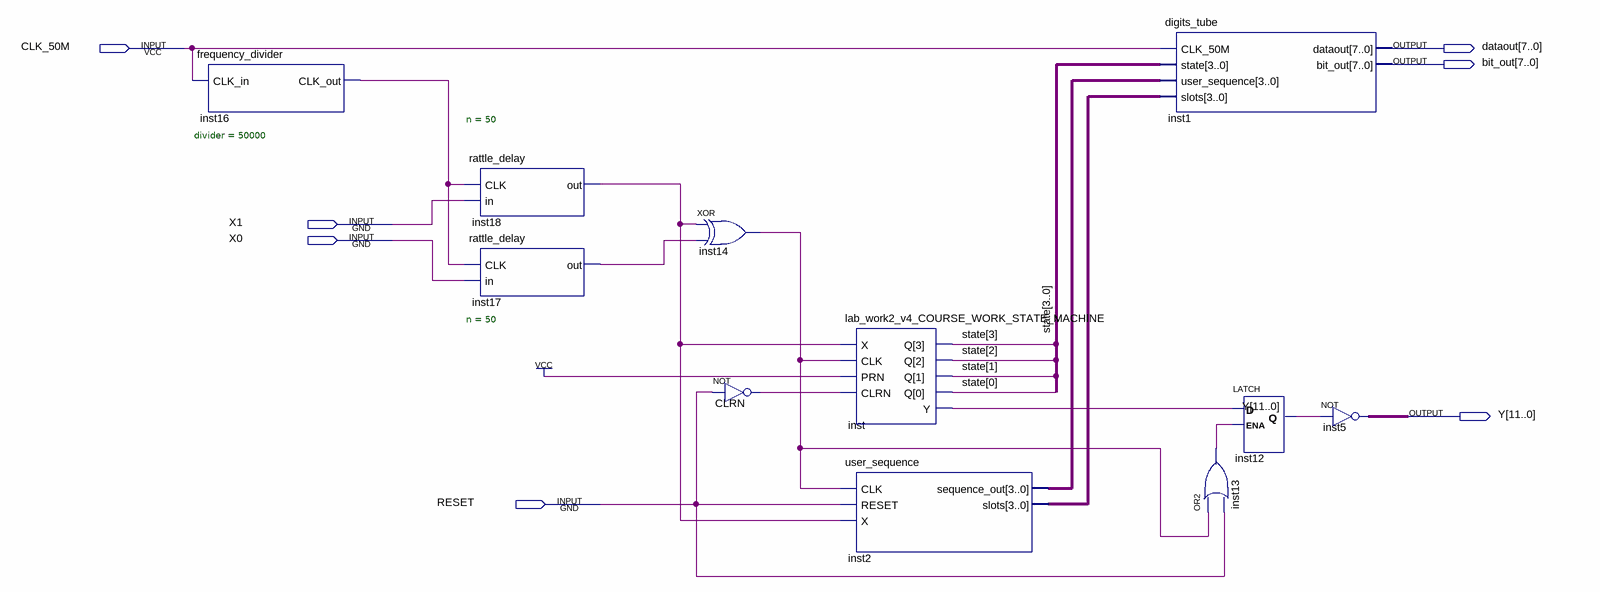
[diagram p0: schematic sheet]
// Quartus schematic lab_work2_v4.bdf as structural Verilog: 11 symbols, 7 pins
module lab_work2_v4 (
  input  CLK_50M,
  input  X1,
  input  X0,
  input  RESET,
  output [7:0] dataout,
  output [7:0] bit_out,
  output [11:0] Y
);

  wire CLRN_out, inst12_q, inst13_out, inst14_out, inst16_clk_out, inst17_out, inst18_out, inst_y;
  wire [3:0] inst2_sequence_out, inst2_slots, state;

  frequency_divider #(.divider(50000)) inst16 (.CLK_in(CLK_50M), .CLK_out(inst16_clk_out));
  rattle_delay #(.n(50)) inst18 (.CLK(inst16_clk_out), .in(X1), .out(inst18_out));
  rattle_delay #(.n(50)) inst17 (.CLK(inst16_clk_out), .in(X0), .out(inst17_out));
  xor inst14 (inst14_out, inst18_out, inst17_out);
  not CLRN (CLRN_out, RESET);
  lab_work2_v4_COURSE_WORK_STATE_MACHINE inst (
    .X(inst18_out), .CLK(inst14_out), .PRN(1'b1), .CLRN(CLRN_out), .Q(state), .Y(inst_y));
  user_sequence inst2 (
    .CLK(inst14_out), .RESET(RESET), .X(inst18_out), .sequence_out(inst2_sequence_out), .slots(inst2_slots));
  digits_tube inst1 (
    .CLK_50M(CLK_50M), .state(state), .user_sequence(inst2_sequence_out), .slots(inst2_slots),
    .dataout(dataout), .bit_out(bit_out));
  or inst13 (inst13_out, inst14_out, RESET);
  LATCH inst12 (.D(inst_y), .ENA(inst13_out), .Q(inst12_q));
  assign Y = ~{12{inst12_q}};  // NOT inst5, 12 bits wide
endmodule
